# EAGLE design programmer-smd (EAGLE 6.6.0)
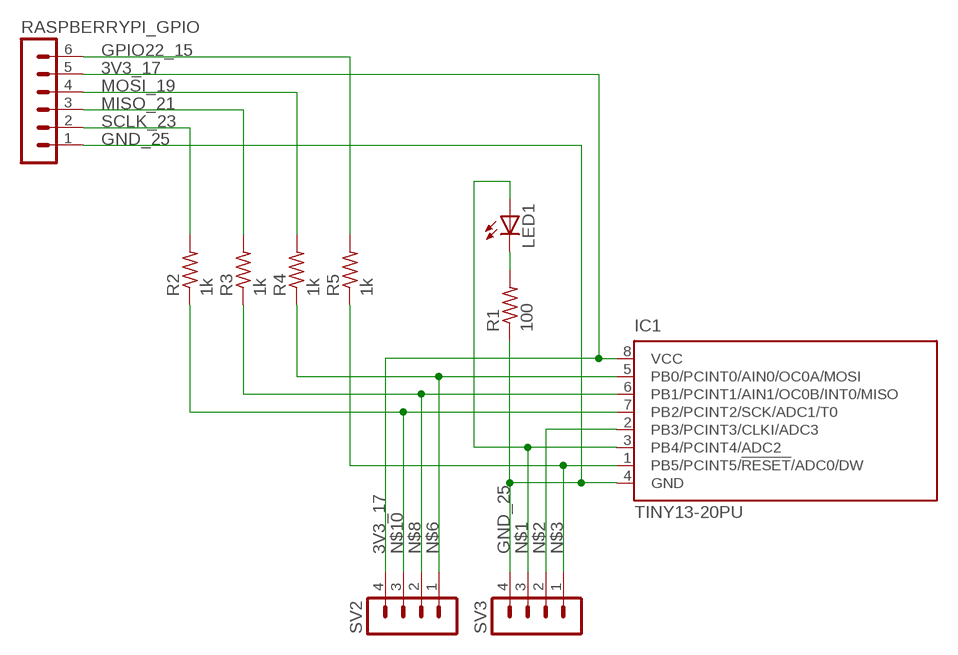
[diagram p0: schematic, sheet 1]

## Parts
IC1  TINY13-20PU  [DIL08]
LED1  LEDCHIP-LED0805  [CHIP-LED0805]
R1  100  R-US_M0805  [M0805]
R2  1k  R-US_M0805  [M0805]
R3  1k  R-US_M0805  [M0805]
R4  1k  R-US_M0805  [M0805]
R5  1k  R-US_M0805  [M0805]
RASPBERRYPI_GPIO  MA06-1  [MA06-1]
SV2  MA04-1  [MA04-1]
SV3  MA04-1  [MA04-1]

## Nets
3V3_17: IC1.8(VCC) RASPBERRYPI_GPIO.5 SV2.4
GND_25: IC1.4(GND) R1.1 RASPBERRYPI_GPIO.1 SV3.4
GPIO22_15: R5.2 RASPBERRYPI_GPIO.6
MISO_21: R3.2 RASPBERRYPI_GPIO.3
MOSI_19: R4.2 RASPBERRYPI_GPIO.4
N$1: IC1.3(PB4/PCINT4/ADC2) LED1.A SV3.3
N$2: IC1.2(PB3/PCINT3/CLKI/ADC3) SV3.2
N$3: IC1.1(PB5/PCINT5/!RESET!/ADC0/DW) R5.1 SV3.1
N$4: LED1.C R1.2
N$6: IC1.5(PB0/PCINT0/AIN0/OC0A/MOSI) R4.1 SV2.1
N$8: IC1.6(PB1/PCINT1/AIN1/OC0B/INT0/MISO) R3.1 SV2.2
N$10: IC1.7(PB2/PCINT2/SCK/ADC1/T0) R2.1 SV2.3
SCLK_23: R2.2 RASPBERRYPI_GPIO.2

## Library data of the parts
IC1 = atmel:TINY13: 8-bit AVR Microcontroller with 1K Bytes In-System Programmable Flash Source: http://www.atmel.com/dyn/resources/prod_documents/2535S.pdf; MPN: ATTINY13-20PU; OC_FARNELL: 9171550; OC_NEWARK: 96K6521
LED1 = led:LED: LED OSRAM: - CHIPLED LG R971, LG N971, LY N971, LG Q971, LY Q971, LO R971, LY R971 LH N974, LH R974 LS Q976, LO Q976, LY Q976 LO Q996 - Hyper CHIPLED LW Q18S LB Q993, LB Q99A, LB R99A - SideLED LS A670, LO A670, LY A670, LG A670, LP A670 LB A673, LV A673, LT A673, LW A673 LH A674 LY A675 LS A676, LA A676, LO A676, LY A676, LW A676 LS A679, LY A679, LG A679 - Hyper Micro SIDELED® LS Y876, LA Y876, LO Y876, LY Y876 LT Y87S - SmartLED LW L88C, LW L88S LB L89C, LB L89S, LG L890 LS L89K, LO L89K, LY L89K LS L896, LA L896, LO L896, LY L896 - TOPLED LS T670, LO T670, LY T670, LG T670, LP T670 LSG T670, LSP T670, LSY T670, LOP T670, LYG T670 LG T671, LOG T671, LSG T671 LB T673, LV T673, LT T673, LW T673 LH T674 LS T676, LA T676, LO T676, LY T676, LB T676, LH T676, LSB T676, LW T676 LB T67C, LV T67C, LT T67C, LS T67K, LO T67K, LY T67K, LW E67C LS E67B, LA E67B, LO E67B, LY E67B, LB E67C, LV E67C, LT E67C LW T67C LS T679, LY T679, LG T679 LS T770, LO T770, LY T770, LG T770, LP T770 LB T773, LV T773, LT T773, LW T773 LH T774 LS E675, LA E675, LY E675, LS T675 LS T776, LA T776, LO T776, LY T776, LB T776 LHGB T686 LT T68C, LB T68C - Hyper Mini TOPLED® LB M676 - Mini TOPLED Santana® LG M470 LS M47K, LO M47K, LY M47K Source: http://www.osram.convergy.de LUXEON: - LUMILED® LXK2-PW12-R00, LXK2-PW12-S00, LXK2-PW14-U00, LXK2-PW14-V00 LXK2-PM12-R00, LXK2-PM12-S00, LXK2-PM14-U00 LXK2-PE12-Q00, LXK2-PE12-R00, LXK2-PE12-S00, LXK2-PE14-T00, LXK2-PE14-U00 LXK2-PB12-K00, LXK2-PB12-L00, LXK2-PB12-M00, LXK2-PB14-N00, LXK2-PB14-P00, LXK2-PB14-Q00 LXK2-PR12-L00, LXK2-PR12-M00, LXK2-PR14-Q00, LXK2-PR14-R00 LXK2-PD12-Q00, LXK2-PD12-R00, LXK2-PD12-S00 LXK2-PH12-R00, LXK2-PH12-S00 LXK2-PL12-P00, LXK2-PL12-Q00, LXK2-PL12-R00 Source: www.luxeon.com KINGBRIGHT: KA-3528ASYC Source: www.kingbright.com
R1-R5 = resistor:R-US_: RESISTOR, American symbol
RASPBERRYPI_GPIO = parts:MA06-1: PIN HEADER; OC_FARNELL: unknown; OC_NEWARK: unknown
SV2 SV3 = parts:MA04-1: PIN HEADER; OC_FARNELL: unknown; OC_NEWARK: unknown

## Board
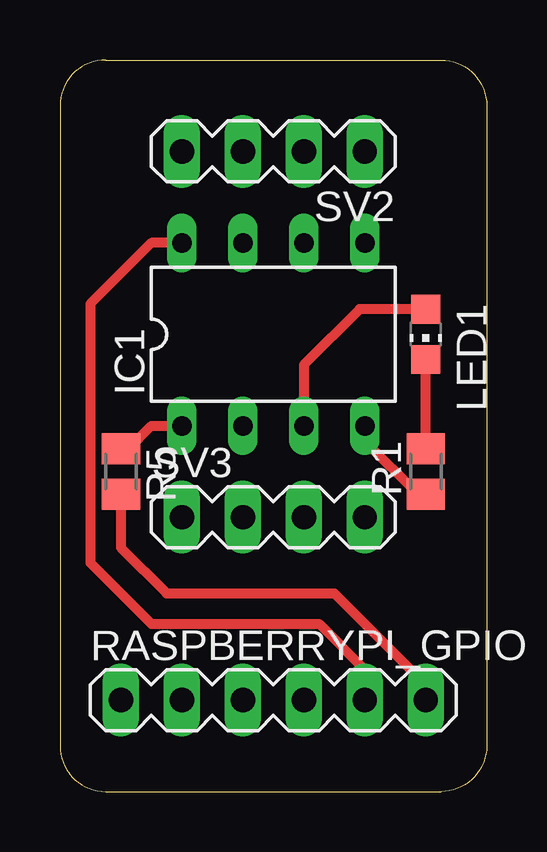
[diagram p1: board, top side]
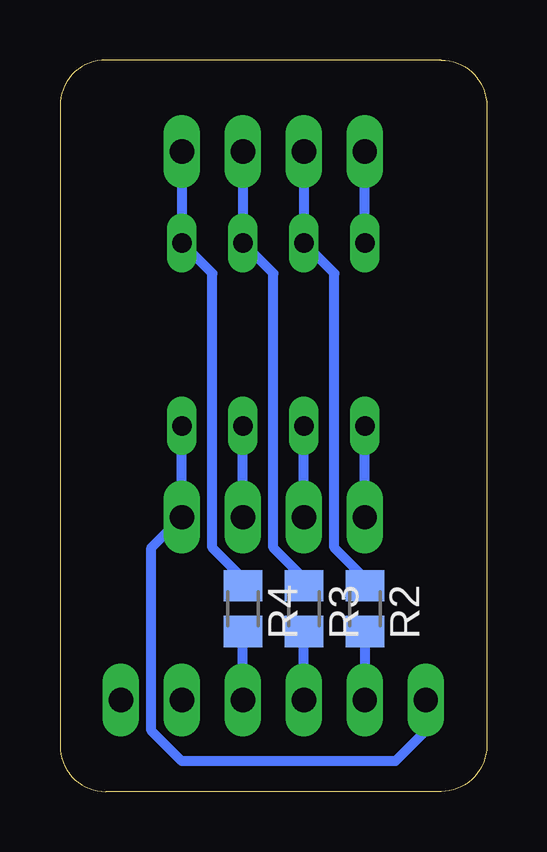
[diagram p2: board, bottom side, seen from below]

Size 17.78 x 30.48 mm. Coordinates in mm from the lower left corner, seen from the top.
Outline: 0,28.57 0,1.91 arc90 1.91,0 15.88,0 arc90 17.78,1.91 17.78,28.57 arc90 15.88,30.48 1.91,30.48 arc90 0,28.57
Copper layers (1*16): Top 0.0356mm / dielectric 1.5011mm / Bottom 0.0356mm
Design rules "oshpark-2layer": minimum track width 6mil, minimum drill 13mil, track to track 6mil, track to pad 6mil, pad to pad 6mil, via to via 6mil, smd to smd 6mil, copper to edge 15mil, drill to drill 6mil, minimum pad ring 7mil, minimum via ring 7mil, stop-mask expansion 2.5mil, vias tented up to drill 0mil, thermal gap 10mil

### Footprints (pad centres in the part's own frame; a part is rotated, then mirrored left to right if it is on the bottom)
DIL08 = drill 0.813 long: 1 -3.81,-3.81; 2 -1.27,-3.81; 3 1.27,-3.81; 4 3.81,-3.81; 5 3.81,3.81; 6 1.27,3.81; 7 -1.27,3.81; 8 -3.81,3.81
CHIP-LED0805 = smd 1.2 x 1.2: A 0,-1.05; C 0,1.05
M0805 = smd 1.3 x 1.6: 1 -0.95,0; 2 0.95,0
MA06-1 = drill 1.016 long: 1 -6.35,0; 2 -3.81,0; 3 -1.27,0; 4 1.27,0; 5 3.81,0; 6 6.35,0
MA04-1 = drill 1.016 long: 1 -3.81,0; 2 -1.27,0; 3 1.27,0; 4 3.81,0

### Placement (x,y rotation side)
IC1  8.89,19.05 0 top
LED1  15.24,19.05 180 top
R1  15.24,13.34 90 top
R2  5.08,7.62 270 bottom
R3  7.62,7.62 270 bottom
R4  10.16,7.62 270 bottom
R5  2.54,13.34 270 top
RASPBERRYPI_GPIO  8.89,3.81 0 top
SV2  8.89,26.67 180 top
SV3  8.89,11.43 0 top

### Tracks (layer width: path | path; a pad name or v marks a point on that pad's centre or on a via)
3V3_17
  Top 0.406: RASPBERRYPI_GPIO.5 12.7,5.08 10.79,6.99 3.81,6.99 1.27,9.53 1.27,20.32 3.81,22.86 IC1.8
  Bottom 0.406: IC1.8 SV2.4
GND_25
  Top 0.406: R1.1 14.92,12.38 12.7,14.61 IC1.4
  Bottom 0.406: IC1.4 SV3.4 13.97,10.16 13.97,2.54 12.7,1.27 3.81,1.27 2.54,2.54 RASPBERRYPI_GPIO.1
GPIO22_15
  Top 0.406: R5.2 2.54,10.16 4.45,8.26 11.43,8.26 15.24,4.45 RASPBERRYPI_GPIO.6
MISO_21
  Bottom 0.406: RASPBERRYPI_GPIO.3 R3.2
MOSI_19
  Bottom 0.406: RASPBERRYPI_GPIO.4 R4.2
N$1
  Top 0.406: LED1.A 12.48,20.1 10.16,17.78 IC1.3
  Bottom 0.406: SV3.3 IC1.3
N$2
  Bottom 0.406: SV3.2 IC1.2
N$3
  Top 0.406: R5.1 2.85,14.29 3.81,15.24 IC1.1
  Bottom 0.406: SV3.1 IC1.1
N$4
  Top 0.406: R1.2 LED1.C
N$6
  Bottom 0.406: R4.1 10.16,8.89 11.43,10.16 11.43,21.59 IC1.5 SV2.1
N$8
  Bottom 0.406: R3.1 7.62,8.89 8.89,10.16 8.89,21.59 IC1.6 SV2.2
N$10
  Bottom 0.406: R2.1 5.08,8.89 6.35,10.16 6.35,21.59 IC1.7 SV2.3
SCLK_23
  Bottom 0.406: R2.2 RASPBERRYPI_GPIO.2

### Text on the board
tOrigins: 8 | 7 | 6 | 5 | uC | 1k | 100 | 1 | 2 | 3 | 4 | GND | SCLK | MISO | MOSI | 3V3 | GPIO22 | 25 | 23 | 21 | 19 | 17 | 15
bOrigins: programmer | rev A | 1k | 1k | 1k